# Altium schematic sheet Skema Seven Segment.SchDoc
size A4
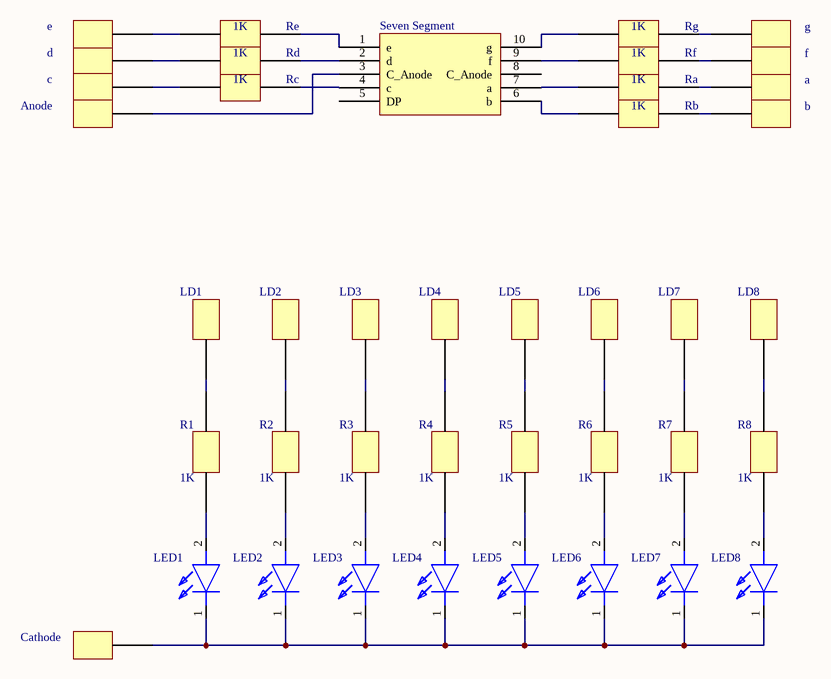
[diagram p0: Skema Seven Segment.SchDoc]

## Parts
a  Female_Connector_Banana  [F_Banana]  (value not drawn)
Anode  Female_Connector_Banana  [F_Banana]  (value not drawn)
b  Female_Connector_Banana  [F_Banana]  (value not drawn)
c  Female_Connector_Banana  [F_Banana]  (value not drawn)
Cathode  Female_Connector_Banana  [F_Banana]  (value not drawn)
d  Female_Connector_Banana  [F_Banana]  (value not drawn)
e  Female_Connector_Banana  [F_Banana]  (value not drawn)
f  Female_Connector_Banana  [F_Banana]  (value not drawn)
g  Female_Connector_Banana  [F_Banana]  (value not drawn)
LD1  Female_Connector_Banana  [F_Banana]  (value not drawn)
LD2  Female_Connector_Banana  [F_Banana]  (value not drawn)
LD3  Female_Connector_Banana  [F_Banana]  (value not drawn)
LD4  Female_Connector_Banana  [F_Banana]  (value not drawn)
LD5  Female_Connector_Banana  [F_Banana]  (value not drawn)
LD6  Female_Connector_Banana  [F_Banana]  (value not drawn)
LD7  Female_Connector_Banana  [F_Banana]  (value not drawn)
LD8  Female_Connector_Banana  [F_Banana]  (value not drawn)
LED1  228-5045  [2285045]  (value not drawn)
LED2  228-5045  [2285045]  (value not drawn)
LED3  228-5045  [2285045]  (value not drawn)
LED4  228-5045  [2285045]  (value not drawn)
LED5  228-5045  [2285045]  (value not drawn)
LED6  228-5045  [2285045]  (value not drawn)
LED7  228-5045  [2285045]  (value not drawn)
LED8  228-5045  [2285045]  (value not drawn)
R1  1K  [Resistor]
R2  1K  [Resistor]
R3  1K  [Resistor]
R4  1K  [Resistor]
R5  1K  [Resistor]
R6  1K  [Resistor]
R7  1K  [Resistor]
R8  1K  [Resistor]
Ra  1K  [Resistor]
Rb  1K  [Resistor]
Rc  1K  [Resistor]
Rd  1K  [Resistor]
Re  1K  [Resistor]
Rf  1K  [Resistor]
Rg  1K  [Resistor]
Seven_Segment  5161AS-Seven-Segment  [5161AS-Seven-Segment]  (value not drawn)

## Nets
Neta_1: a.1(IO) Ra.2
NetAnode_1: Anode.1(IO) Seven_Segment.3(C_Anode)
Netb_1: b.1(IO) Rb.2
Netc_1: c.1(IO) Rc.1
NetCathode_1: Cathode.1(IO) LED1.1(K) LED2.1(K) LED3.1(K) LED4.1(K) LED5.1(K) LED6.1(K) LED7.1(K) LED8.1(K)
Netd_1: d.1(IO) Rd.1
Nete_1: e.1(IO) Re.1
Netf_1: f.1(IO) Rf.2
Netg_1: g.1(IO) Rg.2
NetLD1_1: LD1.1(IO) R1.2
NetLD2_1: LD2.1(IO) R2.2
NetLD3_1: LD3.1(IO) R3.2
NetLD4_1: LD4.1(IO) R4.2
NetLD5_1: LD5.1(IO) R5.2
NetLD6_1: LD6.1(IO) R6.2
NetLD7_1: LD7.1(IO) R7.2
NetLD8_1: LD8.1(IO) R8.2
NetLED1_2: LED1.2(A) R1.1
NetLED2_2: LED2.2(A) R2.1
NetLED3_2: LED3.2(A) R3.1
NetLED4_2: LED4.2(A) R4.1
NetLED5_2: LED5.2(A) R5.1
NetLED6_2: LED6.2(A) R6.1
NetLED7_2: LED7.2(A) R7.1
NetLED8_2: LED8.2(A) R8.1
NetRa_1: Ra.1 Seven_Segment.7(a)
NetRb_1: Rb.1 Seven_Segment.6(b)
NetRc_2: Rc.2 Seven_Segment.4(c)
NetRd_2: Rd.2 Seven_Segment.2(d)
NetRe_2: Re.2 Seven_Segment.1(e)
NetRf_1: Rf.1 Seven_Segment.9(f)
NetRg_1: Rg.1 Seven_Segment.10(g)

Not connected (* = marked no-connect by the designer): Seven_Segment 5(DP) 8(C_Anode)

## Library data of the parts
LED1-LED8 = 228-5045: LED; Manufacturer_Name: RS Components; Datasheet Link: https://docs-emea.rs-online.com/webdocs/1382/0900766b813828ab.pdf; Height: 8.95mm; Manufacturer_Part_Number: 228-5045
R1-R8 Ra Rb Rc Rd Re Rf Rg = Resistor: Fixed Resistance